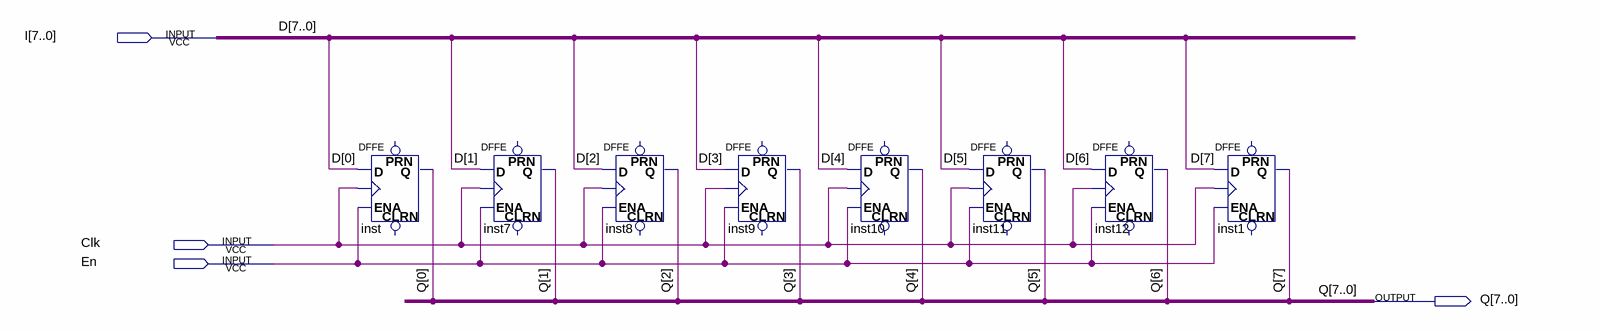
[diagram p0: schematic sheet]
// Quartus schematic Register_8bit.bdf as structural Verilog: 8 symbols, 4 pins
module Register_8bit (
  input  [7:0] I,
  input  Clk,
  input  En,
  output [7:0] Q
);

  DFFE inst (.D(I[0]), .CLK(Clk), .ENA(En), .Q(Q[0]));  // open: PRN, CLRN
  DFFE inst7 (.D(I[1]), .CLK(Clk), .ENA(En), .Q(Q[1]));  // open: PRN, CLRN
  DFFE inst8 (.D(I[2]), .CLK(Clk), .ENA(En), .Q(Q[2]));  // open: PRN, CLRN
  DFFE inst9 (.D(I[3]), .CLK(Clk), .ENA(En), .Q(Q[3]));  // open: PRN, CLRN
  DFFE inst10 (.D(I[4]), .CLK(Clk), .ENA(En), .Q(Q[4]));  // open: PRN, CLRN
  DFFE inst11 (.D(I[5]), .CLK(Clk), .ENA(En), .Q(Q[5]));  // open: PRN, CLRN
  DFFE inst12 (.D(I[6]), .CLK(Clk), .ENA(En), .Q(Q[6]));  // open: PRN, CLRN
  DFFE inst1 (.D(I[7]), .CLK(Clk), .ENA(En), .Q(Q[7]));  // open: PRN, CLRN

  // Other names for the same wires on the sheet: D[7:0] = I
endmodule
